# EAGLE design power-dist-board2 (EAGLE 9.6.2)
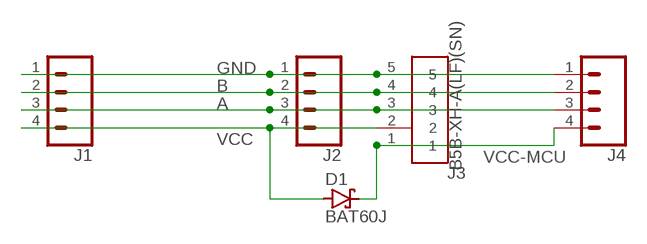
[diagram p0: schematic, sheet 1]

## Parts
D1  BAT60J  [SOD323_ST]
J1  CONN_04  [1X04]
J2  CONN_04  [1X04]
J3  B5B-XH-A(LF)(SN)  [JST_B5B-XH-A(LF)(SN)]
J4  CONN_04  [1X04]

## Nets
A: J1.3 J2.3 J3.3 J4.3
B: J1.2 J2.2 J3.4 J4.2
GND: J1.1 J2.1 J3.5 J4.1
VCC: D1.A J1.4 J2.4 J3.2
VCC-MCU: D1.C J3.1 J4.4

## Library data of the parts
D1 = diode:BAT60J: Schottky barrier diode Source: www.st.com, BAT60J.pdf
J1 J2 J4 = RoverWing-cover-V1.6:CONN_04: Multi connection point. Often used as Generic Header-pin footprint for 0.1 inch spaced/style header connections On any of the 0.1 inch spaced packages, you can populate with these: Break Away Headers - Straight <https://www.sparkfun.com/products/116> (PRT-00116) Break Away Male Headers - Right Angle <https://www.sparkfun.com/products/553> (PRT-00553) Female Headers <https://www.sparkfun.com/products/115> (PRT-00115) Break Away Headers - Machine Pin <https://www.sparkfun.com/products/117> (PRT-00117) Break Away Female Headers - Swiss Machine Pin <https://www.sparkfun.com/products/743> (PRT-00743) For SCREWTERMINALS and SPRING TERMINALS visit here: Screw Terimnals on SparkFun.com <https://www.sparkfun.com/search/results?term=Screw+Terminals> (5mm/3.5mm/2.54mm spacing) This device is also useful as a general connection point to wire up your design to another part of your project. Our various solder wires solder well into these plated through hole pads. Hook-Up Wire - Assortment (Stranded, 22 AWG) <https://www.sparkfun.com/products/11375> (PRT-11375) Hook-Up Wire - Assortment (Solid Core, 22 AWG) <https://www.sparkfun.com/products/11367> (PRT-11367) View the entire wire category on our website here <https://www.sparkfun.com/categories/141> Special notes: Molex polarized connector foot print use with SKU : PRT-08231 with associated crimp pins and housings. 1MM SMD Version SKU: PRT-10208; PROD_ID: CONN-09696
J3 = B4B-XH-A_LF__SN_:B5B-XH-A(LF)(SN)

## Board
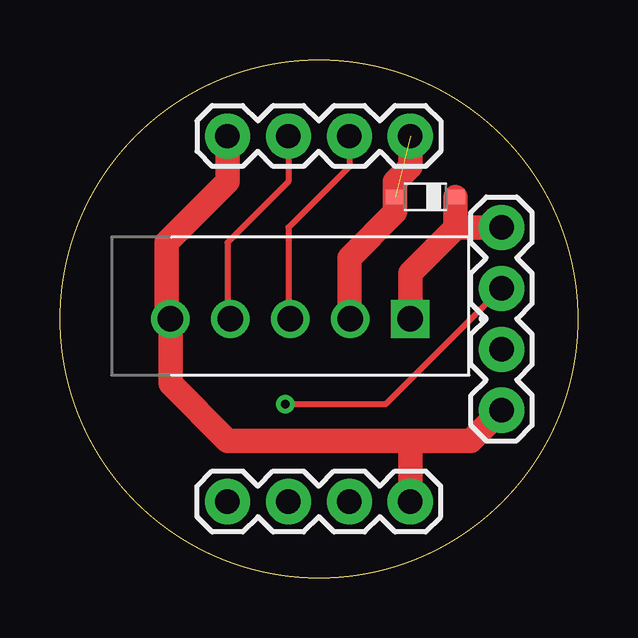
[diagram p1: board, top side]
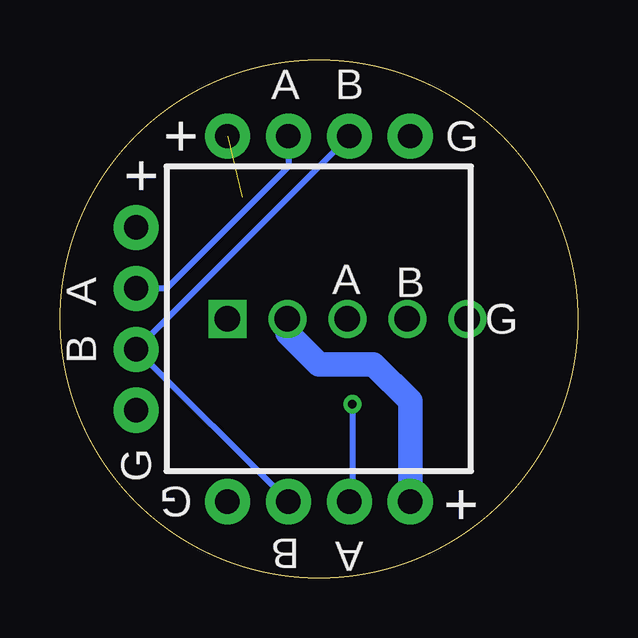
[diagram p2: board, bottom side, seen from below]

Size 21.59 x 21.59 mm. Coordinates in mm from the lower left corner, seen from the top.
Outline: circle at 10.79,10.79 radius 10.79
Copper layers (1*16): Top 0.035mm / dielectric 1.5mm / Bottom 0.035mm
Design rules "default": minimum track width 6mil, minimum drill 0.35mm, track to track 6mil, track to pad 6mil, pad to pad 6mil, via to via 6mil, smd to smd 6mil, copper to edge 40mil, drill to drill 6mil, minimum pad ring 10mil, minimum via ring 8mil, stop-mask expansion 4mil, vias tented up to drill 0mil, thermal gap 10mil

### Footprints (pad centres in the part's own frame; a part is rotated, then mirrored left to right if it is on the bottom)
SOD323_ST = smd 0.8 x 0.6: A 1.25,0; C -1.25,0
1X04 = drill 1.016 pad 1.88: 1 0,0; 2 2.54,0; 3 5.08,0; 4 7.62,0
JST_B5B-XH-A(LF)(SN) = drill 1.06 square: 1 0,0 | drill 1.06: 2 2.5,0; 3 5,0; 4 7.5,0; 5 10,0

### Placement (x,y rotation side)
D1  15.24,15.88 180 top
J1  6.98,18.41 0 top
J2  14.61,3.17 180 top
J3  14.61,10.79 180 top
J4  18.41,6.98 90 top

### Tracks (layer width: path | path; a pad name or v marks a point on that pad's centre or on a via)
A  (via drill 0.35)
  Top 0.254: J1.3 12.06,17.14 9.53,14.61 9.53,10.88 J3.3 | v9.4,7.24 13.59,7.24 J4.3
  Bottom 0.254: J1.3 12.06,17.14 17.14,12.06 J4.3 | J2.3 9.4,3.3 v9.4,7.24
B
  Top 0.254: J1.2 9.53,16.51 6.98,13.97 6.98,10.91 J3.4
  Bottom 0.254: J1.2 J4.2 J2.2
GND
  Top 1.016: J1.1 6.98,16.51 4.45,13.97 4.45,10.96 J3.5 4.6,8.09 6.98,5.71 14.61,5.71 | 14.61,5.71 J2.1 | J4.1 17.14,5.71 14.61,5.71
VCC  (1 unrouted)
  Top 1.016: J1.4 14.61,17.14 13.97,16.51 13.97,15.24 12.06,13.34 12.06,10.83 J3.2
  Bottom 1.016: J3.2 12.11,10.2 10.79,8.89 8.51,8.89 6.98,7.37 J2.4
VCC-MCU
  Top 1.016: J3.1 14.61,12.7 16.51,14.61 | J4.4 16.51,14.61 | 16.51,14.61 16.49,14.62 D1.C

### Text on the board
bPlace: B | A | G | B | A | A | G | B | G | G | A | B
bNames: + | + | +